# Altium schematic sheet 3V3.SchDoc
size A4; SheetNumber: 2; SheetTotal: 4
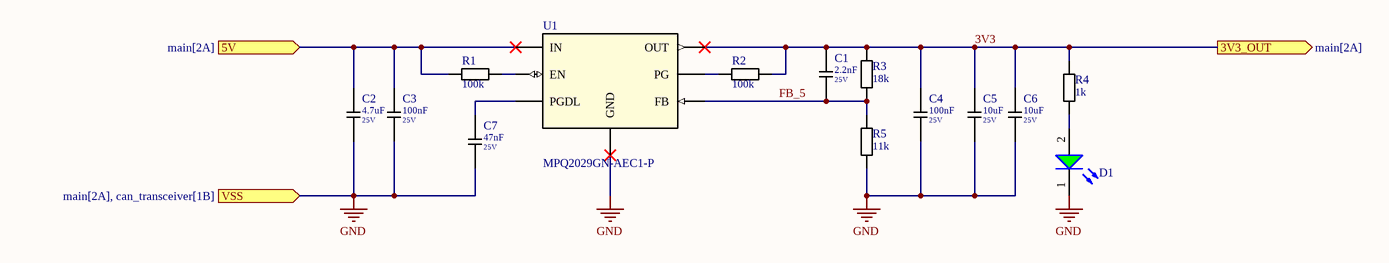
[diagram p0: 3V3.SchDoc]

## Parts
C1  value 2.2nF  Spg: 25V  [0603_C]  (hidden comment: 2.2nF_25V)
C2  value 4.7uF  Spg: 25V  [0603_C]  (hidden comment: 4.7uF_25V)
C3  value 100nF  Spg: 25V  [0603_C]  (hidden comment: 100nF_25V)
C4  value 100nF  Spg: 25V  [0603_C]  (hidden comment: 100nF_25V)
C5  value 10uF  Spg: 25V  [0603_C]  (hidden comment: 10uF_25V)
C6  value 10uF  Spg: 25V  [0603_C]  (hidden comment: 10uF_25V)
C7  value 47nF  Spg: 25V  [0603_C]  (hidden comment: 47nF_25V)
D1  Green, 3.2V, 140°  [WL-SMCD_0603]  (value not drawn)
R1  100k  [0603_R]
R2  100k  [0603_R]
R3  18k  [0603_R]
R4  1k  [0603_R]
R5  11k  [0603_R]
U1  MPQ2029GN-AEC1-P  [SOIC8-EP_MPQ2029_MNP]

## Ports
3V3_OUT (out, see main[2A]), 5V (in, see main[2A]), VSS (in, see main[2A], can_transceiver[1B])

## Nets
GND: C2.2 C3.2 C4.2 C5.2 C6.2 C7.2 D1.1(K) R5.1 U1.3(GND) ; port VSS
3V3: C1.1 C4.1 C5.1 C6.1 R2.2 R3.2 R4.2 U1.1(OUT) ; port 3V3_OUT
5V: C2.1 C3.1 R1.1 U1.4(IN) ; port 5V
FB_5: C1.2 R3.1 R5.2 U1.8(FB)
NetC7_1: C7.1 U1.7(PGDL)
NetD1_2: D1.2(A) R4.1
NetR1_2: R1.2 U1.5(EN)
NetR2_1: R2.1 U1.6(PG)

## Library data of the parts
C1-C7 = C_0603_Keramik: Keramikkondensatoren 0603; EBS_Nummer: %%%; HelpURL: %%%
D1 = 150060GS55040: WL-SMCD Mono-color Chip LED Diffused, SMT, size 0603, Green, 3.2V, 140°; Manufacturer: Wurth Elektronik; Case/Size Code: 0603; Chip Technology: InGaN; Dominant Wavelength: 525nm; Luminous Intensity: 430mcd; Peak Wavelength: 520nm; Manufacturer Part Number: 150060GS55040; Category: Signal LEDs; Match Code: WL-SMCD; ComponentLink1Description: Website Link; ComponentLink1URL: https://www.we-online.com/redexpert/article/150060GS55040?ad; ComponentLink2Description: Datasheet Link; ComponentLink2URL: https://www.we-online.com/redexpert/spec/150060GS55040?ad; Mount: Surface Mount; Operating Temperature Max: 85°C; Operating Temperature Min: -40°C; Packaging: Tape and Reel; Length: 1.6mm; Width: 0.8mm; Height: 0.4mm; Emitting Color: Green; Forward Voltage: 3.2V; Viewing Angle: 140°
R1-R5 = R_0603: R 0603, 75V, 0.1W; EBS_Nummer: %%%; HelpURL: %%%
  R1 R2: Value: 100k
  R3: Value: 18k
  R4: Value: 1k
  R5: Value: 11k
U1 = MPQ2029GN-AEC1-P: No Description Available; pin to pad: 3>3+9; Mfr_Name: Monolithic Power Systems; RefDes: RefDes; Type: Type